# EasyEDA schematic SCH_videoplayer_2022-01-02-EASYEDA.json
TITLE: Debounce 4 inputs; REV: 1.0; Date: 2021-11-22; Sheet: 1/1; Drawn By: Martin Cornu; Company: MartInc
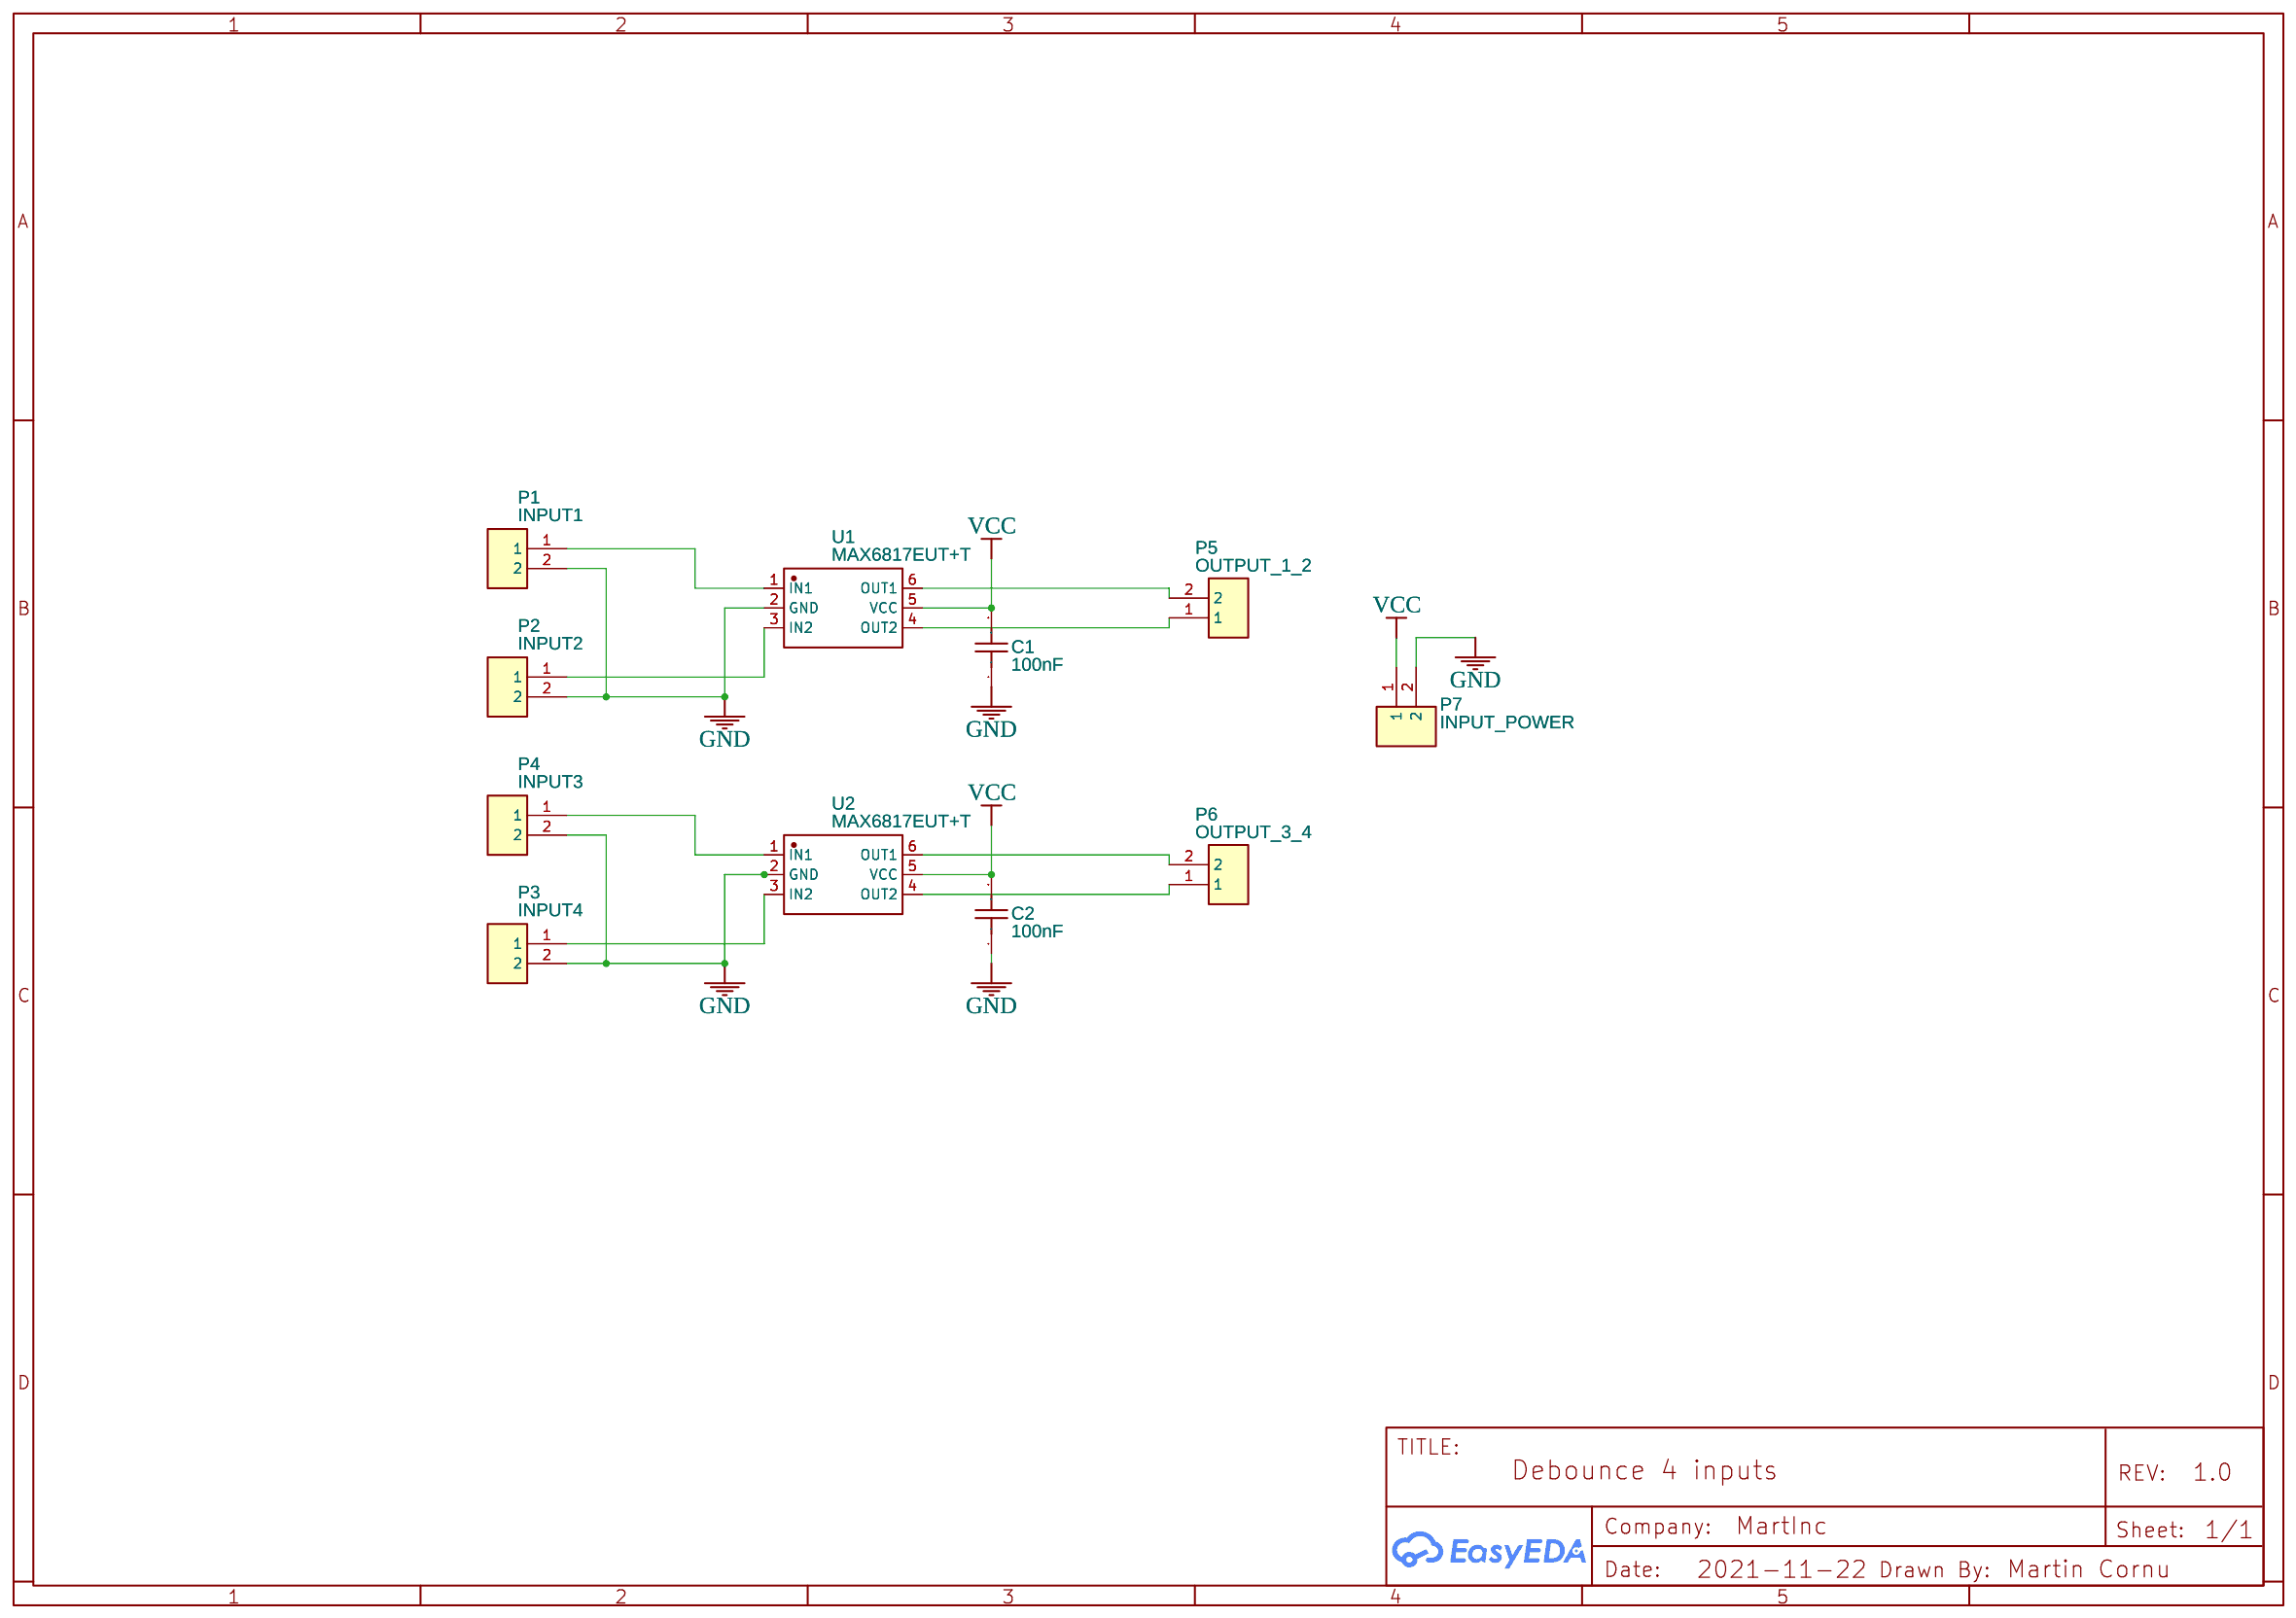
[diagram p0: schematic sheet]

## Parts
C1  100nF  [C0402]
C2  100nF  [C0402]
P1  INPUT1  [TERMINAL_BLOCK-2P-5MM]
P2  INPUT2  [TERMINAL_BLOCK-2P-5MM]
P3  INPUT4  [TERMINAL_BLOCK-2P-5MM]
P4  INPUT3  [TERMINAL_BLOCK-2P-5MM]
P5  OUTPUT_1_2  [TERMINAL_BLOCK-2P-5MM]
P6  OUTPUT_3_4  [TERMINAL_BLOCK-2P-5MM]
P7  INPUT_POWER  [TERMINAL_BLOCK-2P-5MM]
U1  MAX6817EUT+T  [SOT-23-6_L2.9-W1.6-P0.95-LS2.8-BR]
U2  MAX6817EUT+T  [SOT-23-6_L2.9-W1.6-P0.95-LS2.8-BR]

## Library data of the parts
C1 C2 = GRM155R61C104KA88D: Supplier: LCSC; Manufacturer: MuRata; Supplier Part: C77005
P1-P7 = TERMINAL_2P_5MM: Supplier Part: undefined; Contributor: Ivan75
U1 U2 = MAX6817EUT+T: Supplier: LCSC; Supplier Part: C516788; Manufacturer: Maxim Integrated; Contributor: LCSC; JLCPCB Part Class: Extended Part

## Nets
GND: C1.1 C2.1 P1.2 P2.2 P3.2 P4.2 P7.2 U1.2(GND) U2.2(GND)
VCC: C1.2 C2.2 P7.1 U1.5(VCC) U2.5(VCC)
Net-(P1-1): P1.1 U1.1(IN1)
Net-(P2-1): P2.1 U1.3(IN2)
Net-(P3-1): P3.1 U2.3(IN2)
Net-(P4-1): P4.1 U2.1(IN1)
Net-(P5-1): P5.1 U1.4(OUT2)
Net-(P5-2): P5.2 U1.6(OUT1)
Net-(P6-1): P6.1 U2.4(OUT2)
Net-(P6-2): P6.2 U2.6(OUT1)
